# EAGLE design plu-rel2d (EAGLE 9.4.0)
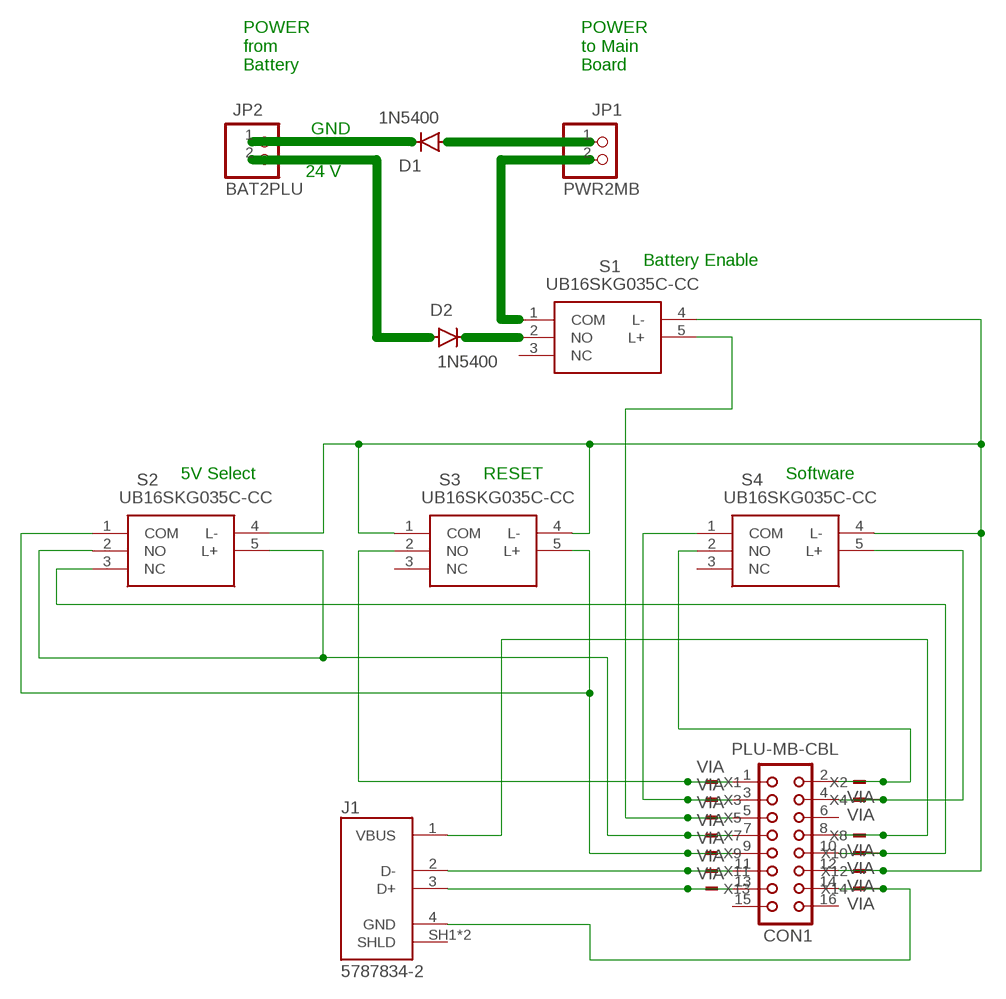
[diagram p0: schematic, sheet 1]

## Parts
CON1  PLU-MB-CBL  CON16  [CON16]
D1  1N5400  [DO201-15]
D2  1N5400  [DO201-15]
J1  5787834-2  [TE_5787834-2]
JP1  PWR2MB  PINHD-1X2  [1X02]
JP2  BAT2PLU  PINHD-1X2  [1X02]
S1  UB16SKG035C-CC  [UB16SKG035CCC]
S2  UB16SKG035C-CC  [UB16SKG035CCC]
S3  UB16SKG035C-CC  [UB16SKG035CCC]
S4  UB16SKG035C-CC  [UB16SKG035CCC]
X1  VIA  TSW-101-08-G-S  [TSW-101-XX-G-S]
X2  VIA  TSW-101-08-G-S  [TSW-101-XX-G-S]
X3  VIA  TSW-101-08-G-S  [TSW-101-XX-G-S]
X4  VIA  TSW-101-08-G-S  [TSW-101-XX-G-S]
X5  VIA  TSW-101-08-G-S  [TSW-101-XX-G-S]
X7  VIA  TSW-101-08-G-S  [TSW-101-XX-G-S]
X8  VIA  TSW-101-08-G-S  [TSW-101-XX-G-S]
X9  VIA  TSW-101-08-G-S  [TSW-101-XX-G-S]
X10  VIA  TSW-101-08-G-S  [TSW-101-XX-G-S]
X11  VIA  TSW-101-08-G-S  [TSW-101-XX-G-S]
X12  VIA  TSW-101-08-G-S  [TSW-101-XX-G-S]
X13  VIA  TSW-101-08-G-S  [TSW-101-XX-G-S]
X14  VIA  TSW-101-08-G-S  [TSW-101-XX-G-S]

## Nets
N$1: D1.A JP1.1
N$2: CON1.1 S3.2(NO) X1.1
N$3: D1.C JP2.1
N$4: D2.C S1.2(NO)
N$5: D2.A JP2.2
N$6: JP1.2 S1.1(COM)
N$7: CON1.3 S4.1(COM) X3.1
N$8: CON1.2 S4.2(NO) X2.1
N$12: CON1.4 S4.5(L+) X4.1
N$13: CON1.8 J1.1(VBUS) X8.1
N$15: CON1.5 S1.5(L+) X5.1
N$17: CON1.7 S2.2(NO) S2.5(L+) X7.1
N$19: CON1.9 S2.1(COM) S3.5(L+) X9.1
N$22: CON1.10 S2.3(NC) X10.1
N$23: CON1.11 J1.2(D-) X11.1
N$24: CON1.13 J1.3(D+) X13.1
N$25: CON1.12 S1.4(L-) S2.4(L-) S3.1(COM) S3.4(L-) S4.4(L-) X12.1
N$29: CON1.14 J1.4(GND) X14.1
Unconnected: CON1.6 CON1.15 CON1.16 J1.SH1(SHLD) J1.SH2(SHLD) S1.3(NC) S3.3(NC) S4.3(NC)

## Notes on the sheet
- POWER
  from
  Battery
- POWER
  to Main
  Board
- GND
- 24 V
- Battery Enable
- 5V Select | RESET | Software

## Library data of the parts
CON1 = con-harting:CON16: CONNECTOR; OC_FARNELL: unknown; OC_NEWARK: unknown
D1 D2 = diode:1N5400: DIODE standard rectifier, 3 A, 50 V (Motorola)
J1 = 5787834-2:5787834-2: Conn USB 2.0 Type B RCP 4 POS 2.5mm Solder ST Thru-Hole 4 Terminal 1 Port Box/Tray; COMMENT: 5787834-2; DESCRIPTION: Conn USB 2.0 Type B RCP 4 POS 2.5mm Solder ST Thru-Hole 4 Terminal 1 Port Box/Tray; DIGI-KEY_PART_NUMBER: A121598-ND; DIGI-KEY_PURCHASE_URL: https://www.digikey.com/product-detail/en/te-connectivity-amp-connectors/5787834-2/A121598-ND/2286710?utm_source=snapeda&utm_medium=aggregator&utm_campaign=symbol; EU_ROHS_COMPLIANCE: Compliant; MF: TE Connectivity; MP: 5787834-2; PACKAGE: None; TE_PURCHASE_URL: https://www.te.com/usa-en/product-5787834-2.html?te_bu=Cor&te_type=disp&te_campaign=seda_glo_cor-seda-global-disp-prtnr-fy19-seda-model-bom-cta_sma-317_1&elqCampaignId=32493
JP1 JP2 = pinhead:PINHD-1X2: PIN HEADER
S1-S4 = UB16SKG035C-CC:UB16SKG035C-CC: Pushbutton Switches ON-ON SQ .4VA RED LED & CAP PC TERM Source: Datasheet <https://www.mouser.com/datasheet/2/295/UBIlluminated-33436.pdf>; ALLIED_NUMBER: 71044456; ALLIED_PRICE-STOCK: https://www.alliedelec.com/nkkswitches-ub16skg035c-cc/71044456/; DESCRIPTION: Pushbutton Switches ON-ON SQ .4VA RED LED & CAP PC TERM; HEIGHT: 13.5mm; MANUFACTURER_NAME: NKK Switches; MANUFACTURER_PART_NUMBER: UB16SKG035C-CC; MOUSER_PART_NUMBER: 633-UB16SKG035CCC; MOUSER_PRICE-STOCK: https://www.mouser.com/Search/Refine.aspx?Keyword=633-UB16SKG035CCC
X1-X5 X7-X14 = con-samtec:TSW-101-*-G-S: THROUGH-HOLE .025" SQ POST HEADER Source: Samtec TSW.pdf; MF: Samtec Inc.; MPN: TSW-101-07-G-S

## Net classes
0 default: width 0.406 mm

## Board
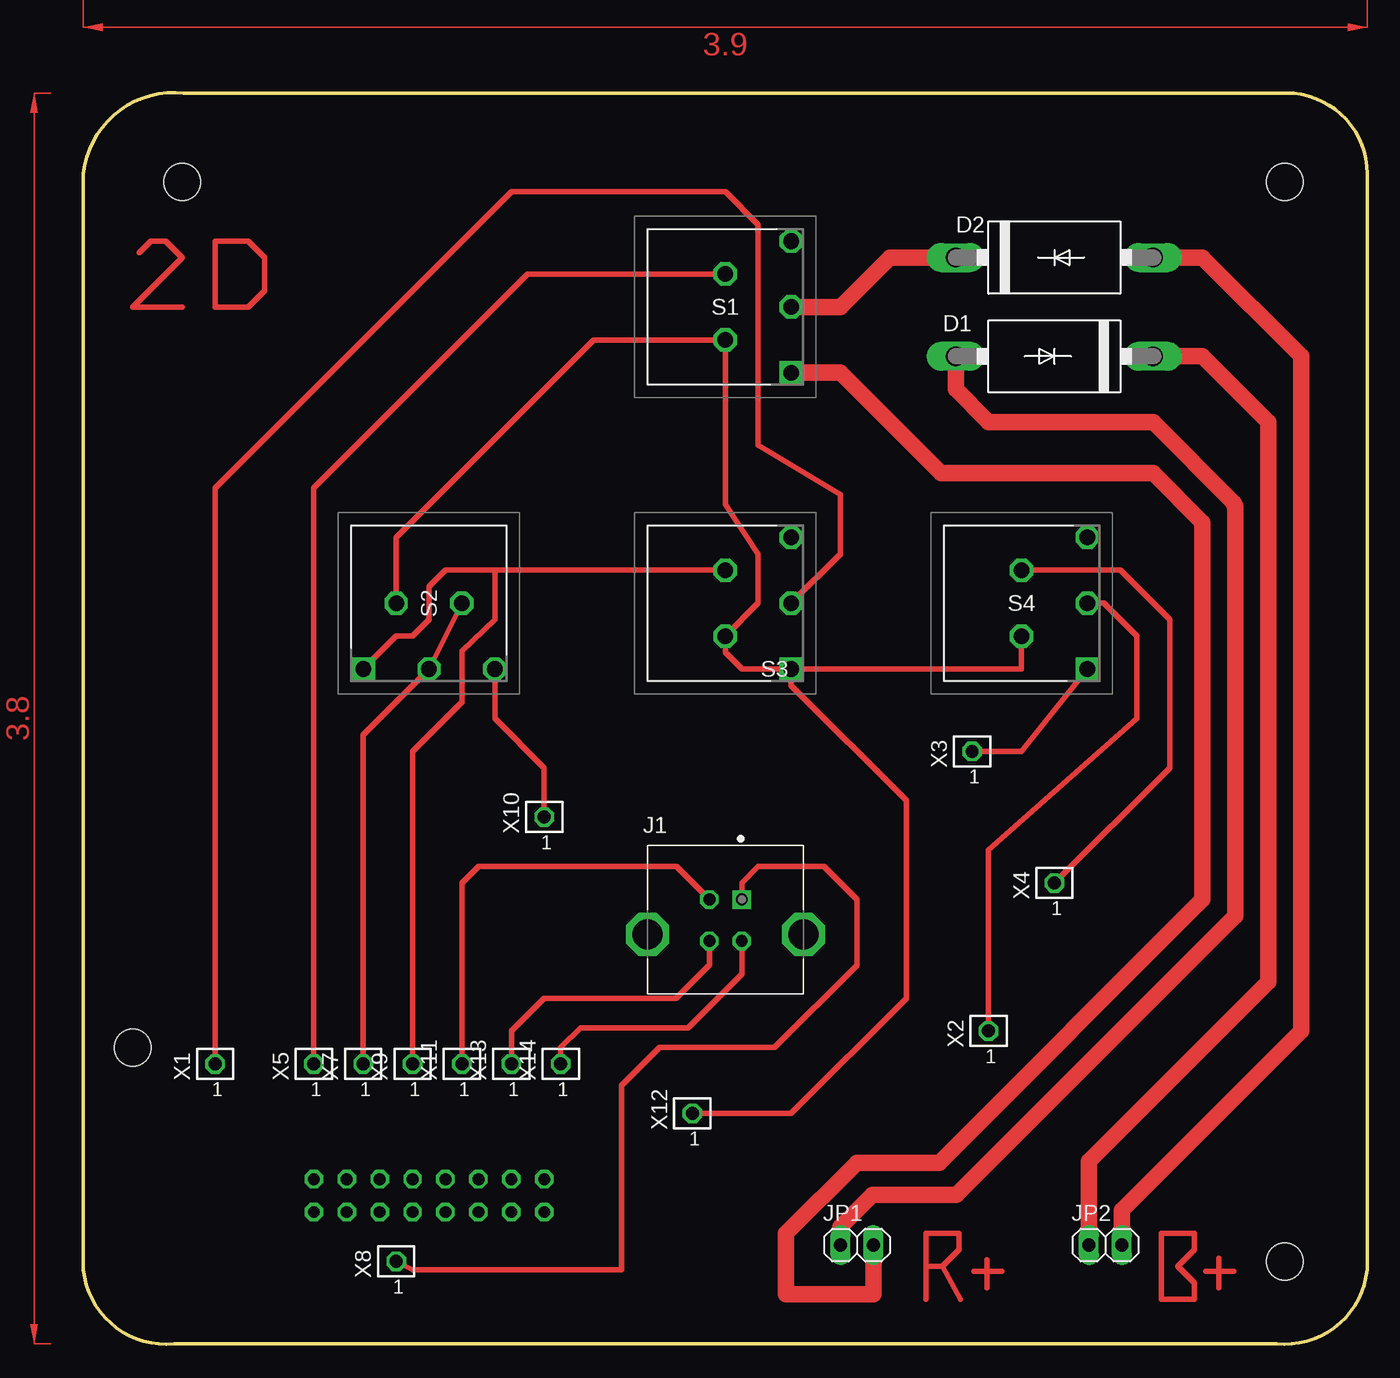
[diagram p1: board, top side]
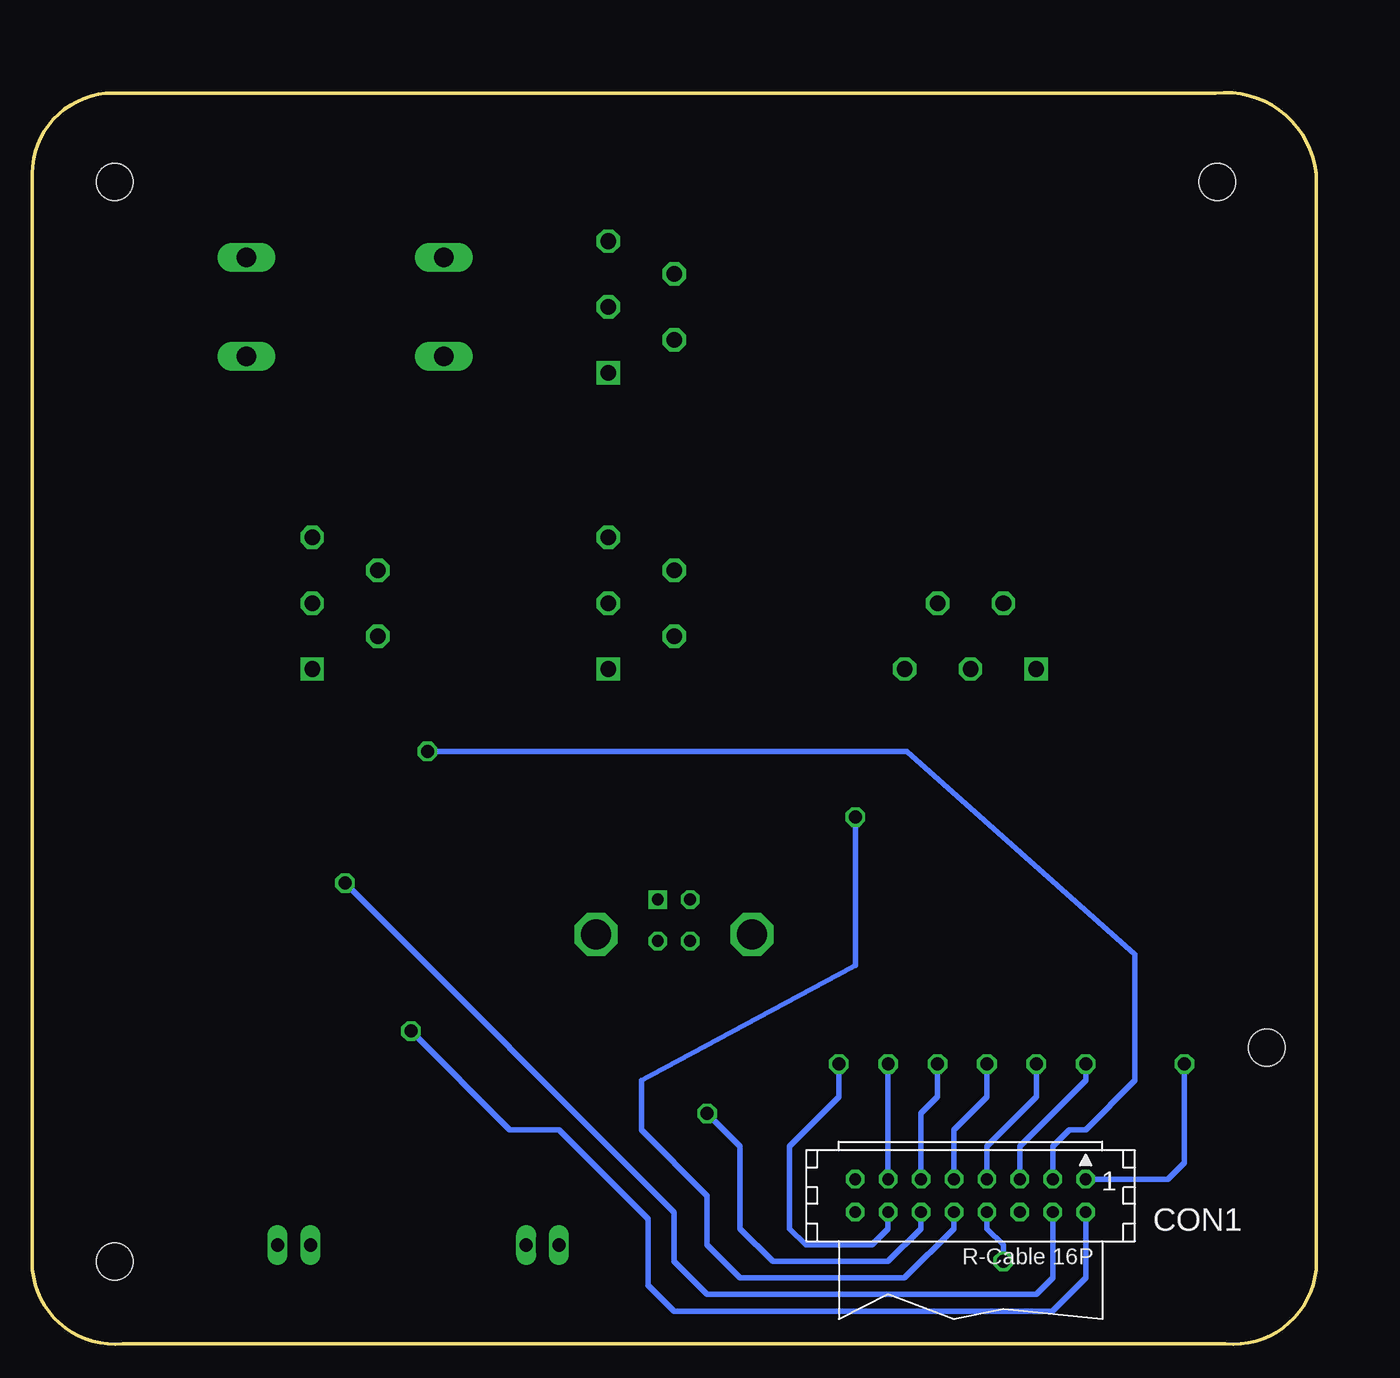
[diagram p2: board, bottom side, seen from below]

Size 99.06 x 96.59 mm. Coordinates in mm from the lower left corner, seen from the top.
Outline: 99.06,90.33 arc90 92.84,96.55 7.75,96.55 arc90 0,90.33 0,5.75 arc90 6.99,0.03 92.08,0.03 arc90 99.06,5.75 99.06,90.33
Copper layers (1*16): Top 0.035mm / dielectric 1.5mm / Bottom 0.035mm
Design rules "default *": minimum track width 6mil, minimum drill 0.35mm, track to track 32mil, track to pad 32mil, pad to pad 32mil, via to via 100mil, smd to smd 6mil, copper to edge 40mil, drill to drill 6mil, minimum pad ring 10mil, minimum via ring 8mil, stop-mask expansion 4mil, vias tented up to drill 0mil, thermal gap 10mil
Holes 2.85 mm at 92.71,89.69 3.81,22.89 7.62,89.69 92.71,6.38

### Footprints (pad centres in the part's own frame; a part is rotated, then mirrored left to right if it is on the bottom)
CON16 = drill 0.914 octagon: 1 -8.89,-1.27; 2 -8.89,1.27; 3 -6.35,-1.27; 4 -6.35,1.27; 5 -3.81,-1.27; 6 -3.81,1.27; 7 -1.27,-1.27; 8 -1.27,1.27; 9 1.27,-1.27; 10 1.27,1.27; 11 3.81,-1.27; 12 3.81,1.27; 13 6.35,-1.27; 14 6.35,1.27; 15 8.89,-1.27; 16 8.89,1.27
DO201-15 = drill 1.499 long: A 7.62,0; C -7.62,0
TE_5787834-2 = drill 0.92 square: 1 0,0 | drill 0.92 octagon: 2 -2.5,0; 3 -2.5,-3.21; 4 0,-3.21 | drill 2.3 octagon: SH1 -7.27,-2.705; SH2 4.77,-2.705
1X02 = drill 1.016 long: 1 -1.27,0; 2 1.27,0
UB16SKG035CCC = drill 1.2 pad 1.8 square: 1 0,0 | drill 1.2 pad 1.8 octagon: 2 0,5.08; 3 0,10.16; 4 -5.08,2.54; 5 -5.08,7.62
TSW-101-XX-G-S = drill 1 pad 1.5 octagon: 1 0,0

### Placement (x,y rotation side)
CON1  26.67,11.46 180 bottom
D1  74.93,76.23 180 top
D2  74.93,83.85 0 top
J1  50.8,34.32 0 top
JP1  59.69,7.65 0 top
JP2  78.87,7.65 0 top
S1  54.61,74.96 0 top
S2  21.59,52.1 270 top
S3  54.61,52.1 0 top
S4  77.47,52.1 0 top
X1  10.16,21.62 0 top
X2  69.85,24.16 0 top
X3  68.58,45.75 0 top
X4  74.93,35.59 0 top
X5  17.78,21.62 0 top
X7  21.59,21.62 0 top
X8  24.13,6.38 0 top
X9  25.4,21.62 0 top
X10  35.56,40.67 0 top
X11  29.21,21.62 0 top
X12  46.99,17.81 0 top
X13  33.02,21.62 0 top
X14  36.83,21.62 0 top

### Tracks (layer width: path | path; a pad name or v marks a point on that pad's centre or on a via)
N$1
  Top 0.406: 88.77,64.93 88.77,64.8
  Top 1.27: D1.A 67.31,73.69 69.85,71.15 82.55,71.15 88.77,64.93 | 88.77,64.8 88.9,64.67 88.9,33.05 67.37,11.52 60.9,11.52 58.42,9.05 JP1.1
N$2
  Top 0.406: S3.2 58.42,60.99 58.42,65.56 52.07,69.37 52.07,86.39 49.53,88.93 33.02,88.93 10.16,66.07 X1.1
  Bottom 0.406: CON1.1 11.43,12.73 10.16,14 X1.1
N$3
  Top 1.27: D1.C 86.36,76.23 91.44,71.15 91.44,27.97 77.6,14.13 JP2.1
N$4
  Top 1.27: D2.C 62.23,83.85 58.42,80.04 S1.2
N$5
  Top 1.27: D2.A 86.36,83.85 93.98,76.23 93.98,24.16 80.14,10.32 JP2.2
N$6
  Top 1.27: S1.1 58.42,74.96 66.17,67.21 82.55,67.21 86.36,63.4 86.36,34.32 66.04,14 59.69,14 54.23,8.54 54.23,3.84 60.96,3.84 JP1.2
N$7
  Top 0.406: S4.1 72.39,45.75 X3.1
  Bottom 0.406: CON1.3 20.32,15.27 19.05,16.54 17.78,16.54 13.97,20.35 13.97,30.09 31.59,45.75 X3.1
N$8
  Top 0.406: X2.1 69.85,38.13 81.28,48.29 81.28,54.64 78.74,57.18 S4.2
  Bottom 0.406: X2.1 62.23,16.54 58.42,16.54 51.56,9.68 51.56,4.55 49.53,2.52 20.32,2.52 20.32,2.57 17.78,5.11 CON1.2
N$9
  Top 0.406: 83.19,8.54 85.72,8.54 85.72,7.27 84.45,6 85.72,4.73 85.72,3.46 83.19,3.46 83.19,8.54
N$10
  Top 0.406: 10.16,80.04 10.16,85.12 12.7,85.12 13.97,83.85 13.97,81.31 12.7,80.04 10.16,80.04
N$12
  Top 0.406: X4.1 83.82,44.48 83.82,55.91 80.01,59.72 S4.5
  Bottom 0.406: X4.1 49.53,10.19 49.53,6.38 46.99,3.84 21.59,3.84 20.32,5.11 CON1.4
N$13
  Top 0.406: J1.1 50.8,35.59 52.07,36.86 57.15,36.86 59.69,34.32 59.69,29.24 53.34,22.89 44.45,22.89 41.53,19.97 41.53,5.75 25.4,5.75 X8.1
  Bottom 0.406: X8.1 24.13,7.65 25.4,8.92 CON1.8
N$15
  Top 0.406: S1.5 34.29,82.58 17.78,66.07 X5.1
  Bottom 0.406: X5.1 17.78,20.35 22.86,15.27 CON1.5
N$17
  Top 0.406: X7.1 21.59,47.02 S2.2 S2.5
  Bottom 0.406: X7.1 21.59,19.08 25.4,15.27 CON1.7
N$19
  Top 0.406: S2.1 24.13,54.64 25.4,54.64 26.67,55.91 26.67,58.45 27.94,59.72 31.75,59.72 | S3.5 31.75,59.72 | 31.75,59.72 31.75,55.91 29.21,53.5 29.21,49.56 25.4,45.75 X9.1
  Bottom 0.406: X9.1 25.4,19.08 27.94,16.54 CON1.9
N$21
  Top 0.406: 87.63,6.64 87.63,5.62 | 87.63,5.62 87.63,4.35 | 87.63,5.62 88.77,5.62 | 87.63,5.62 86.61,5.62
N$22
  Top 0.406: S2.3 31.75,48.29 35.56,44.48 X10.1
  Bottom 0.406: CON1.10 27.94,8.92 31.75,5.11 44.45,5.11 46.99,7.65 46.99,11.46 52.07,16.54 52.07,20.35 35.56,29.24 X10.1
N$23
  Top 0.406: X11.1 29.21,35.59 30.48,36.86 45.76,36.86 J1.2
  Bottom 0.406: CON1.11 30.48,17.81 29.21,19.08 X11.1
N$24
  Top 0.406: X13.1 33.02,24.16 35.56,26.7 45.72,26.7 48.3,29.28 J1.3
  Bottom 0.406: CON1.13 X13.1
N$25
  Top 0.406: S2.4 24.13,62.26 39.37,77.5 S1.4 49.53,64.8 52.07,60.99 52.07,57.18 S3.4 49.53,53.37 50.8,52.1 S3.1 | S3.1 72.39,52.1 S4.4 | S3.1 54.61,50.83 63.5,41.94 63.5,26.7 54.61,17.81 X12.1
  Bottom 0.406: X12.1 44.45,15.27 44.45,8.92 41.91,6.38 33.02,6.38 30.48,8.92 CON1.12
N$26
  Top 0.406: 4.32,84.23 5.21,85.12 6.35,85.12 7.62,83.85 3.81,80.04 7.62,80.04
N$27
  Top 0.406: 65.02,6 66.29,6 | 67.69,3.46 66.29,6 | 66.29,6 67.56,7.27 67.56,8.54 65.02,8.54 65.02,3.46
N$29
  Top 0.406: X14.1 36.83,22.89 38.35,24.42 46.64,24.42 50.8,28.57 J1.4
  Bottom 0.406: CON1.14 33.02,8.92 34.29,7.65 39.37,7.65 40.64,8.92 40.64,15.27 36.83,19.08 X14.1
N$33
  Top 0.406: 68.71,5.62 69.72,5.62 | 69.72,5.62 70.87,5.62 | 69.72,5.62 69.72,6.51 | 69.72,5.62 69.72,4.35
(copper drawn outside any net)
  shapes: Top area x2